# Altium schematic sheet PeripheralInterface.SchDoc: PeripheralInterface
size A4; Organization: Altium Limited; Address1: L3, 12a Rodborough Rd; Address2: Frenchs Forest; Address3: NSW; Address4: Australia 2086
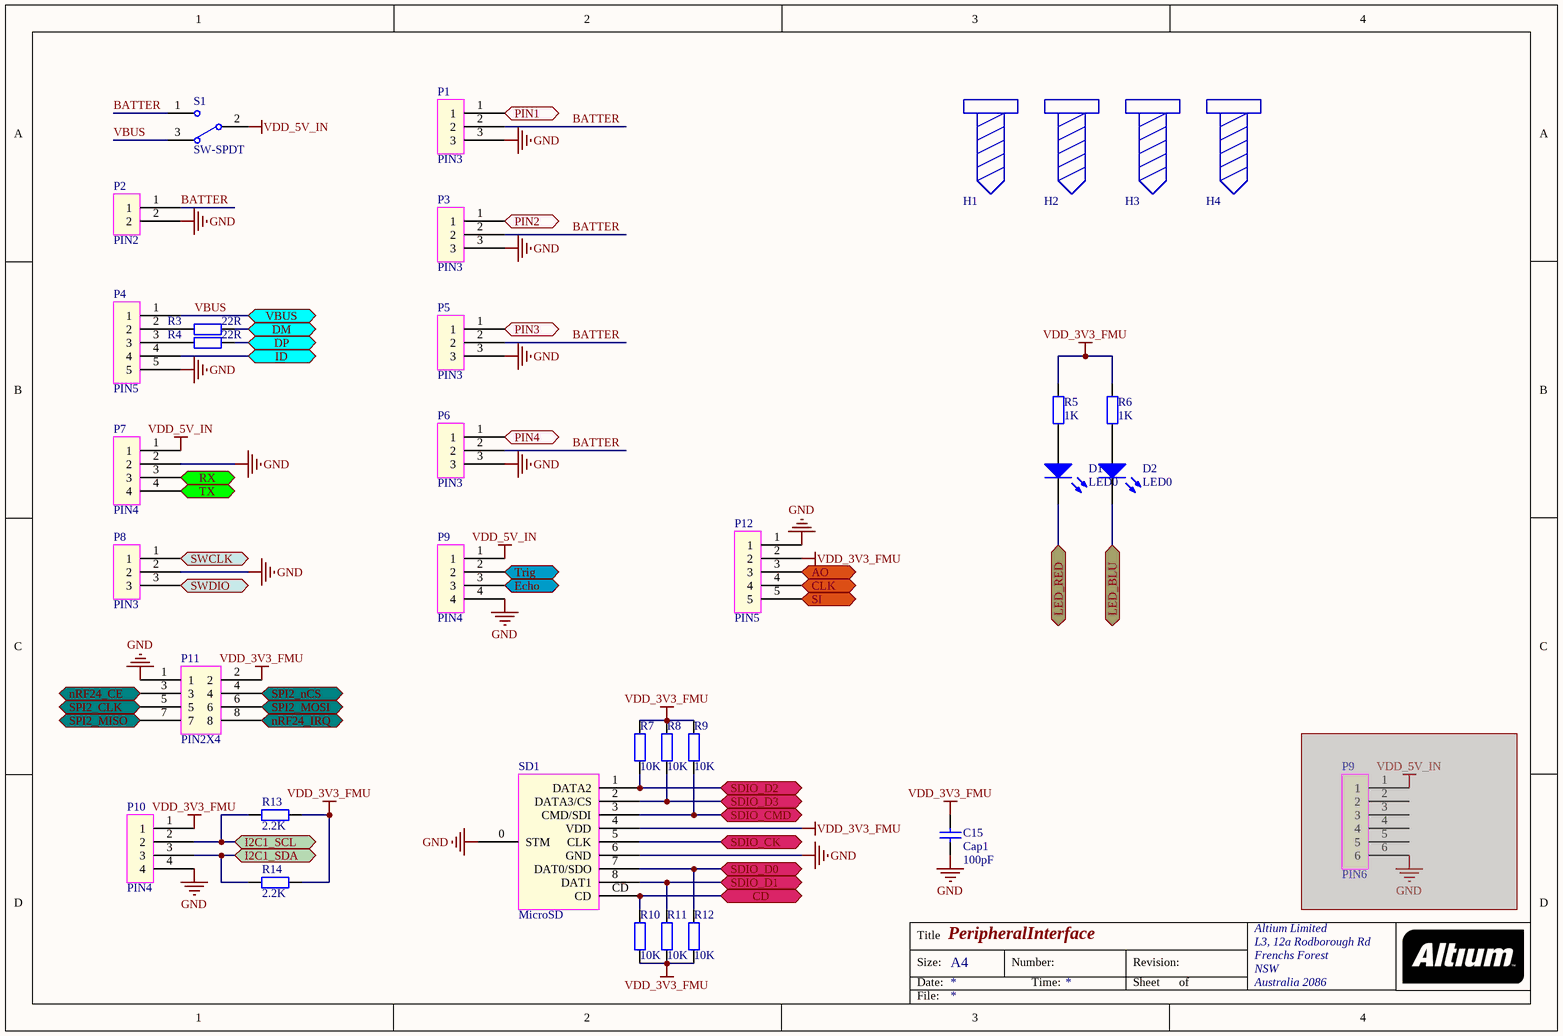
[diagram p0: PeripheralInterface.SchDoc]

## Parts
(Parts that share a designator on the sheet are numbered #1, #2 ... from top to bottom, then left to right.)
C15  Cap1  value 100pF  [0603AC]
D1  LED0  [LED_G]
D2  LED0  [LED_B]
H1  HOLE  [Hole]  (value not drawn)
H2  HOLE  [Hole]  (value not drawn)
H3  HOLE  [Hole]  (value not drawn)
H4  HOLE  [Hole]  (value not drawn)
P1  PIN3  [Header-3P]
P2  PIN2  [Header-2P]
P3  PIN3  [Header-3P]
P4  PIN5  [mini_USB]
P5  PIN3  [Header-3P]
P6  PIN3  [Header-3P]
P7  PIN4  [Header-4P]
P8  PIN3  [Header-3P]
P9#1  PIN4  [Header-4P]
P9#2  PIN6  [AWT-6]  (masked out: inside a compile mask, not in the netlist)
P10  PIN4  [AWT-4]
P11  PIN2X4  [Header-2X4P]
P12  PIN5  [Header-5P]
R3  value 22R  [0603AR]  (hidden comment: Resist)
R4  value 22R  [0603AR]  (hidden comment: Resist)
R5  value 1K  [0603AR]  (hidden comment: Resist)
R6  value 1K  [0603AR]  (hidden comment: Resist)
R7  value 10K  [0603AR]  (hidden comment: Resist)
R8  value 10K  [0603AR]  (hidden comment: Resist)
R9  value 10K  [0603AR]  (hidden comment: Resist)
R10  value 10K  [0603AR]  (hidden comment: Resist)
R11  value 10K  [0603AR]  (hidden comment: Resist)
R12  value 10K  [0603AR]  (hidden comment: Resist)
R13  value 2.2K  [0603AR]  (hidden comment: Resist)
R14  value 2.2K  [0603AR]  (hidden comment: Resist)
S1  SW-SPDT  [KEY_MSK_12C01_07]
SD1  MicroSD  [MicroSD]

## Ports
AO, CD, CLK, DM, DP, Echo, I2C1_SCL, I2C1_SDA, ID, LED_BLU, LED_RED, nRF24_CE, nRF24_IRQ, PIN1, PIN2, PIN3, PIN4, RX, SDIO_CK, SDIO_CMD, SDIO_D0, SDIO_D1, SDIO_D2, SDIO_D3, SI, SPI2_CLK, SPI2_MISO, SPI2_MOSI, SPI2_nCS, SWCLK, SWDIO, Trig, TX, VBUS

## Nets
GND: C15.1 P1.3 P2.2 P3.3 P4.5 P5.3 P6.3 P7.2 P8.2 P9#1.4 P10.4 P11.1 P12.1 SD1.0(STM) SD1.6(GND)
VDD_3V3_FMU: C15.2 P10.1 P11.2 P12.2 R5.2 R6.2 R7.2 R8.2 R9.2 R10.2 R11.2 R12.2 R13.2 R14.2 SD1.4(VDD)
VDD_5V_IN: P7.1 P9#1.1 S1.2
AO: P12.3 ; port AO
BATTER: P1.2 P2.1 P3.2 P5.2 P6.2 S1.1
CD: R10.1 SD1.CD ; port CD
CLK: P12.4 ; port CLK
DM: R3.2 ; port DM
DP: R4.2 ; port DP
Echo: P9#1.3 ; port Echo
I2C1_SCL: P10.2 R13.1 ; port I2C1_SCL
I2C1_SDA: P10.3 R14.1 ; port I2C1_SDA
ID: P4.4 ; port ID
LED_BLU: D2.2(K) ; port LED_BLU
LED_RED: D1.2(K) ; port LED_RED
nRF24_CE: P11.3 ; port nRF24_CE
nRF24_IRQ: P11.8 ; port nRF24_IRQ
PIN1: P1.1 ; port PIN1
PIN2: P3.1 ; port PIN2
PIN3: P5.1 ; port PIN3
PIN4: P6.1 ; port PIN4
RX: P7.3 ; port RX
SDIO_CK: SD1.5(CLK) ; port SDIO_CK
SDIO_CMD: R9.1 SD1.3(CMD/SDI) ; port SDIO_CMD
SDIO_D0: R12.1 SD1.7(DAT0/SDO) ; port SDIO_D0
SDIO_D1: R11.1 SD1.8(DAT1) ; port SDIO_D1
SDIO_D2: R7.1 SD1.1(DATA2) ; port SDIO_D2
SDIO_D3: R8.1 SD1.2(DATA3/CS) ; port SDIO_D3
SI: P12.5 ; port SI
SPI2_CLK: P11.5 ; port SPI2_CLK
SPI2_MISO: P11.7 ; port SPI2_MISO
SPI2_MOSI: P11.6 ; port SPI2_MOSI
SPI2_nCS: P11.4 ; port SPI2_nCS
SWCLK: P8.1 ; port SWCLK
SWDIO: P8.3 ; port SWDIO
Trig: P9#1.2 ; port Trig
TX: P7.4 ; port TX
VBUS: P4.1 S1.3 ; port VBUS
NetD1_1: D1.1(A) R5.1
NetD2_1: D2.1(A) R6.1
NetP4_2: P4.2 R3.1
NetP4_3: P4.3 R4.1

## Notes on the sheet
- Title
- Size:
- Date:
- A4
- Number:
- Time:
- Revision:
- Sheet
- of
- File:

## Library data of the parts
C15 = Cap1: Capacitor; Published: 8-Jun-2000; LatestRevisionDate: 17-Jul-2002; LatestRevisionNote: Re-released for DXP Platform.; PackageReference: RAD-0.3; Publisher: Altium Limited; PackageDescription: Radial Cap, Thru-Hole; 2 Leads; 0.3 in Pin Spacing
D1 D2 = LED0: Typical INFRARED GaAs LED; Published: 8-Jun-2000; LatestRevisionDate: 08-Jul-2005; LatestRevisionNote: Mech Layer 1 removed.; PackageReference: LED-0; Publisher: Altium Limited; PackageDescription: LED; 2 Leads
R3-R14 = Res
S1 = SW-SPDT: SPDT Subminiature Toggle Switch, Right Angle Mounting, Vertical Actuation; Published: 24-Mar-1999; LatestRevisionDate: 17-Dec-2003; LatestRevisionNote: Schematic revised, PCB Footprint replaced.; DatasheetVersion: 05-Dec-2000; PackageReference: TL36WW15050; Publisher: Altium Limited; PackageDescription: Switch; 4 Leads; ComponentLink1Description: Manufacturer Link; ComponentLink1URL: http://www.apem.com